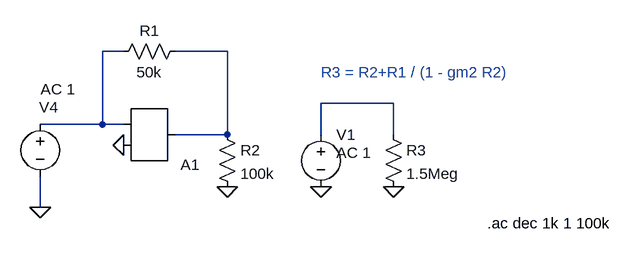
[diagram p0: schematic EJE3_D.asc]
EJE3_D.asc, the LTspice schematic file:
Version 4
SHEET 1 880 680
WIRE -832 -384 -864 -384
WIRE -672 -384 -752 -384
WIRE -416 -304 -528 -304
WIRE -864 -272 -864 -384
WIRE -864 -272 -960 -272
WIRE -832 -272 -864 -272
WIRE -672 -256 -672 -384
WIRE -672 -256 -752 -256
WIRE -528 -256 -528 -304
WIRE -416 -256 -416 -304
WIRE -960 -144 -960 -192
FLAG -960 -144 0
FLAG -832 -240 0
FLAG -672 -176 0
FLAG -528 -176 0
FLAG -416 -176 0
SYMBOL voltage -960 -288 R0
WINDOW 123 1 -38 Left 2
WINDOW 39 0 0 Left 0
WINDOW 0 -2 -10 Left 2
SYMATTR Value2 AC 1
SYMATTR InstName V4
SYMATTR Value ""
SYMBOL SpecialFunctions\\ota -800 -192 M180
WINDOW 3 0 0 Invisible 0
SYMATTR Value G=9u Vlow=-1
SYMATTR InstName A1
SYMBOL res -736 -400 R90
WINDOW 0 0 56 VBottom 2
WINDOW 3 32 56 VTop 2
SYMATTR InstName R1
SYMATTR Value 50k
SYMBOL res -688 -272 R0
SYMATTR InstName R2
SYMATTR Value 100k
SYMBOL res -432 -272 R0
SYMATTR InstName R3
SYMATTR Value 1.5Meg
SYMBOL voltage -528 -272 R0
WINDOW 123 24 44 Left 2
WINDOW 39 0 0 Left 0
SYMATTR Value2 AC 1
SYMATTR InstName V1
SYMATTR Value ""
TEXT -272 -120 Left 2 !.ac dec 1k 1 100k
TEXT -528 -352 Left 2 ;R3 = R2+R1 / (1 - gm2 R2)

The netlist it stands for:
* EJE3_D.asc
V4 N001 0 AC 1
A1 0 N001 0 0 0 0 N002 0 OTA G=9u Vlow=-1
R1 N002 N001 50k
R2 N002 0 100k
R3 N003 0 1.5Meg
V1 N003 0 AC 1
.ac dec 1k 1 100k
* R3 = R2+R1 / (1 - gm2 R2)
.backanno
.end